# EAGLE design ventmon_t0.5b (EAGLE 9.6.2)

## Sheet 1 of 2
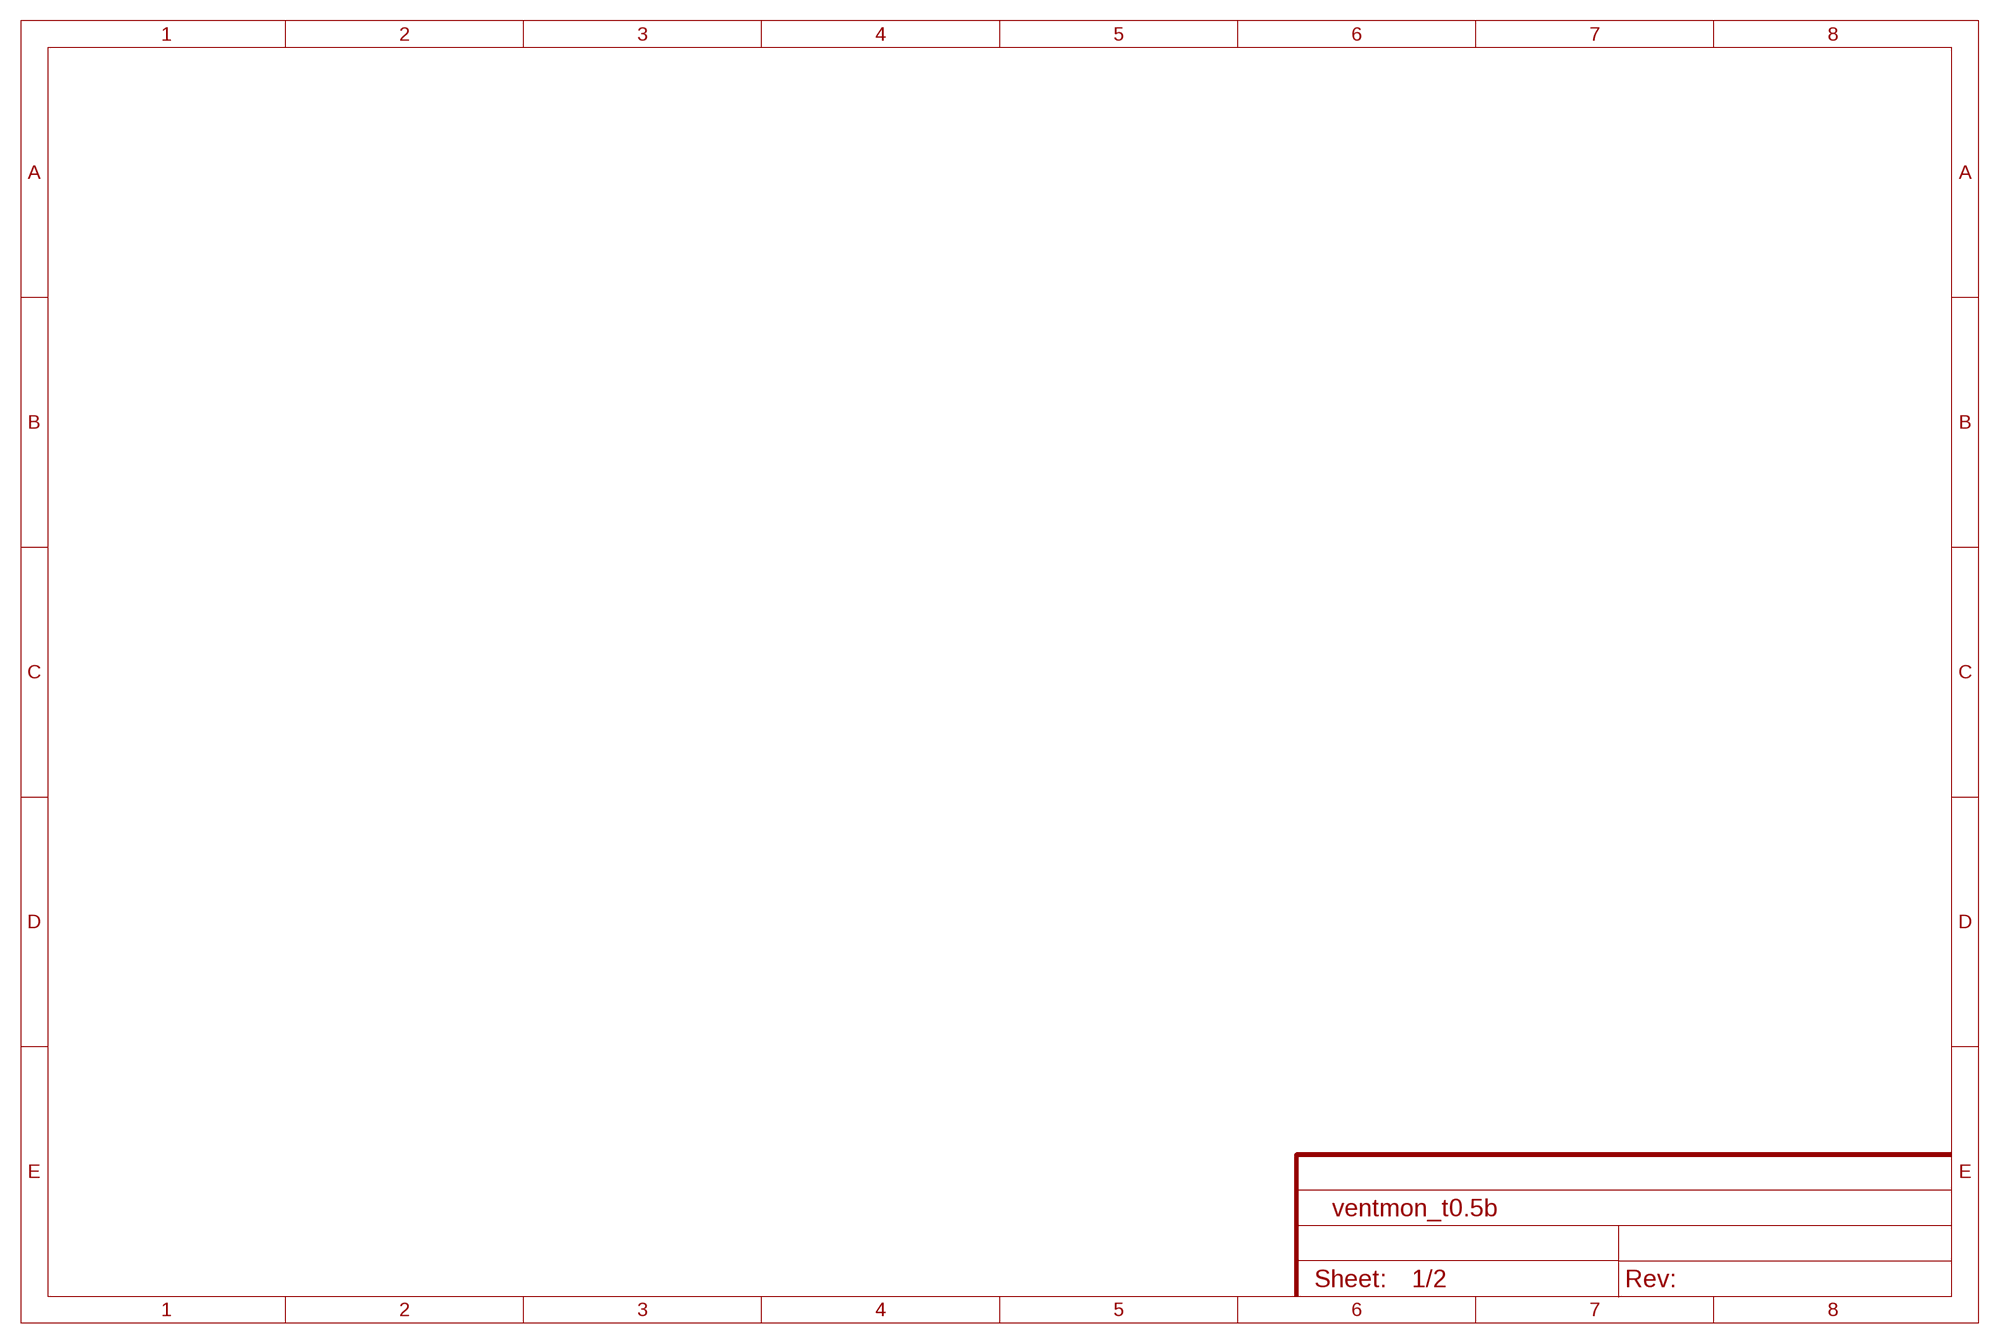
[diagram p0: schematic, sheet 1]

## Sheet 2 of 2
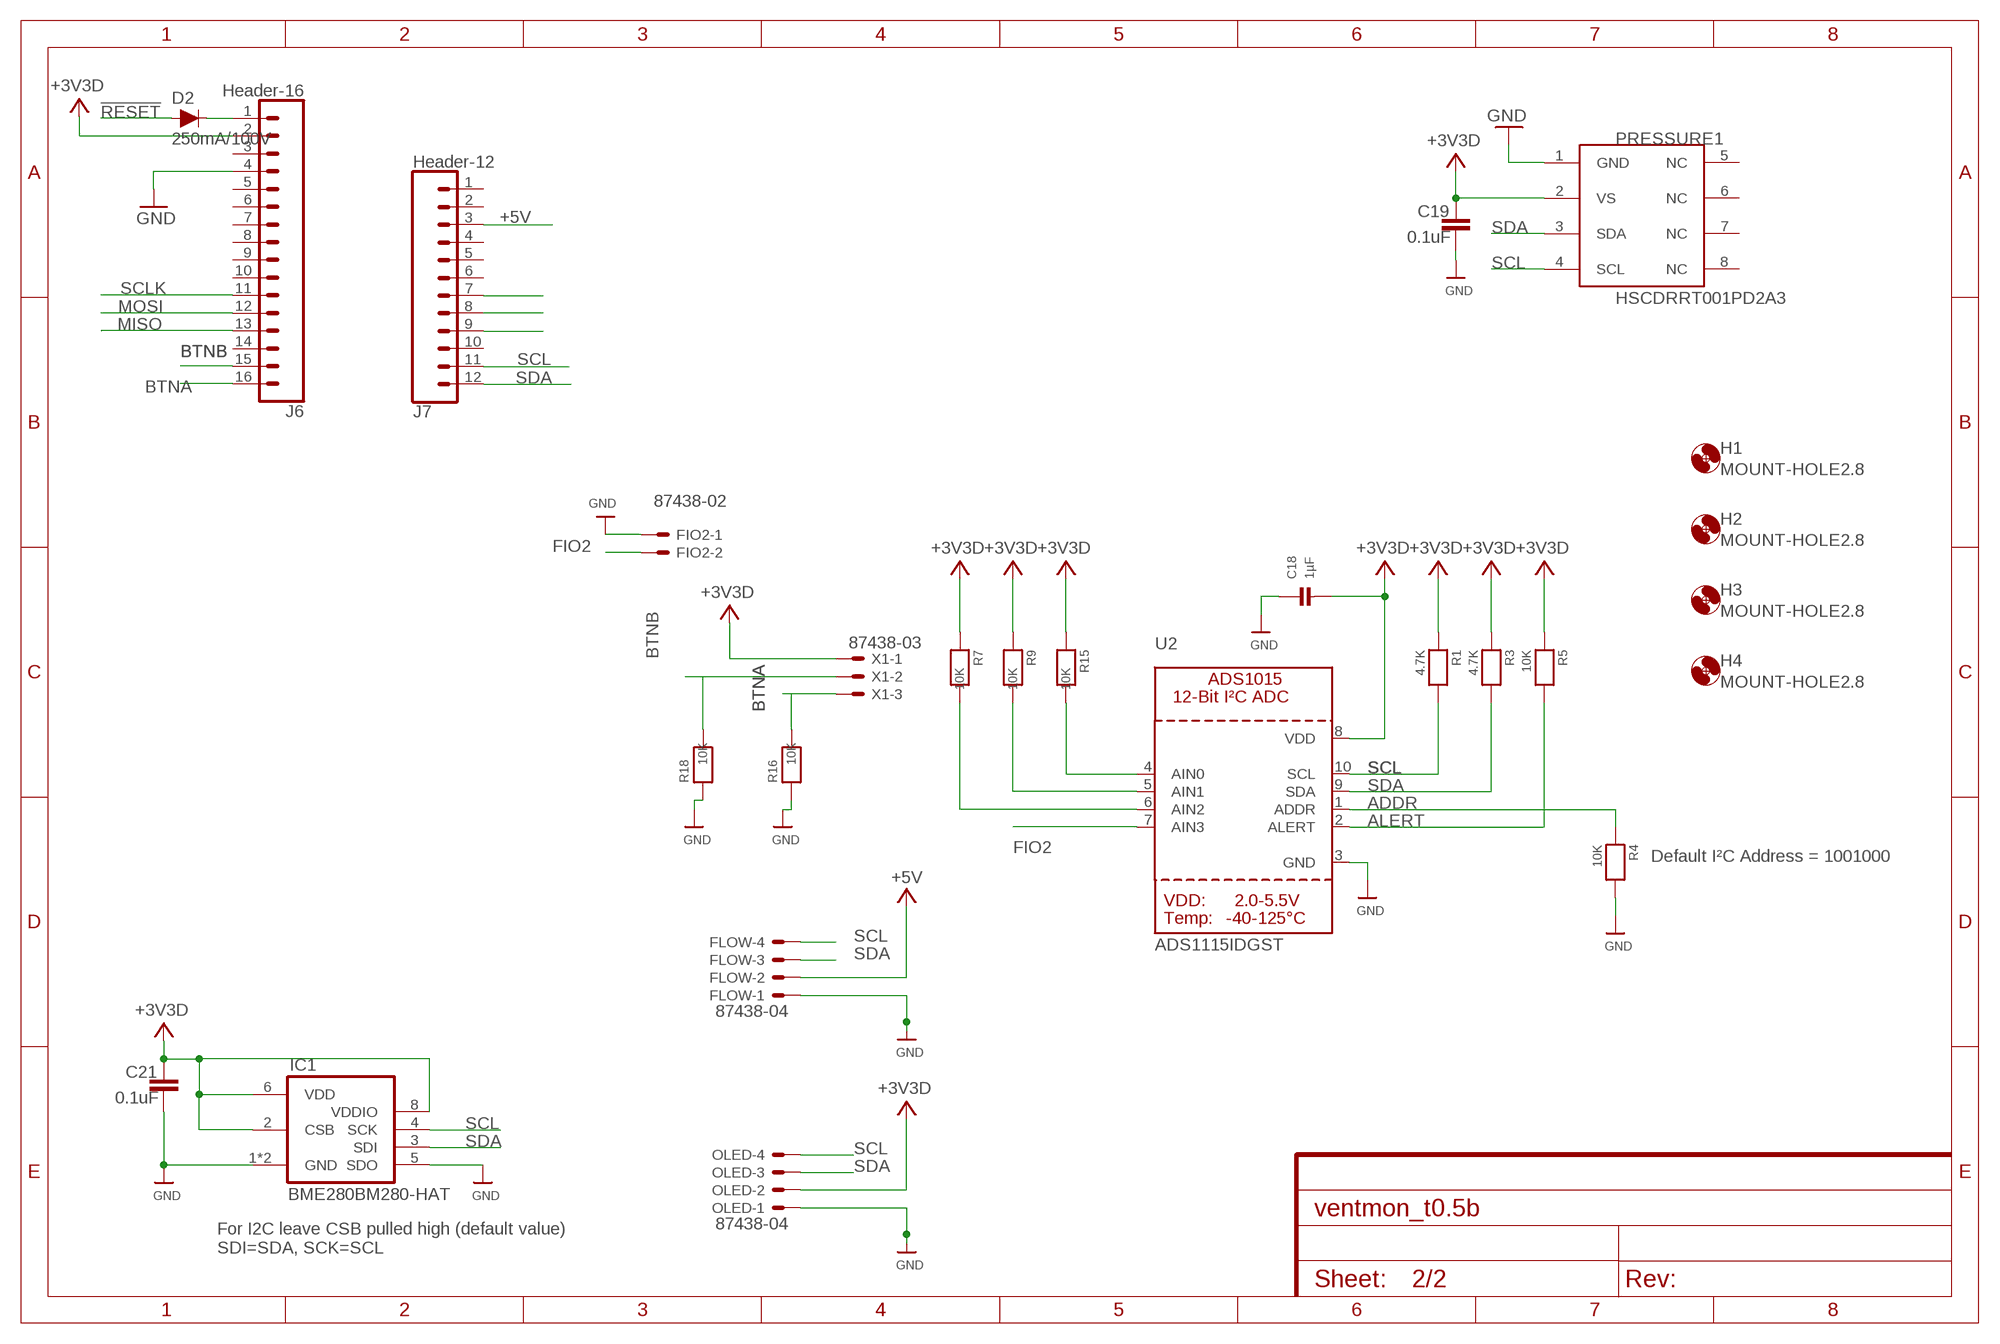
[diagram p1: schematic, sheet 2]

### Parts
C18  1µF  CAP_CERAMIC0603  [0603]
C19  0.1uF  CAP_1  [C0402_B]
C21  0.1uF  CAP_1  [C0402_B]
D2  250mA/100V  DIODE-BAS16J  [SOD-323]
FIO2  87438-02  [87438-02]
FLOW  87438-04  [87438-04]
H1  MOUNT-HOLE2.8  [2,8]
H2  MOUNT-HOLE2.8  [2,8]
H3  MOUNT-HOLE2.8  [2,8]
H4  MOUNT-HOLE2.8  [2,8]
IC1  BME280BM280-HAT  [BME280-HAT]
J6  Header-16  CONN_16  [1X16]
J7  Header-12  CONN_12  [1X12]
OLED  87438-04  [87438-04]
PRESSURE1  HSCDRRT001PD2A3  [DIP1330W46P254L1000H616Q8B]
R1  4.7K  RESISTOR0603  [0603]
R3  4.7K  RESISTOR0603  [0603]
R4  10K  RESISTOR0603  [0603]
R5  10K  RESISTOR0603  [0603]
R7  10K  RESISTOR0603  [0603]
R9  10K  RESISTOR0603  [0603]
R15  10K  RESISTOR0603  [0603]
R16  10K  RESISTOR0603  [0603]
R18  10K  RESISTOR0603  [0603]
U2  ADS1115IDGST  ADC_ADS1015  [MSOP10]
X1  87438-03  [87438-03]

### Nets
!RESET: D2.A
+3V3: C18.2 C19.2 C21.2 IC1.2(CSB) IC1.6(VDD) IC1.8(VDDIO) J6.2 OLED.2 PRESSURE1.2(VS) R1.1 R3.1 R5.1 R7.1 R9.1 R15.1 U2.8(VDD) X1.1 ; supply symbol labelled +3V3D
+5V: FLOW.2 J7.3
ADDR: R4.1 U2.1(ADDR)
ALERT: R5.2 U2.2(ALERT)
BTNA: J6.16 R16.2 X1.3
BTNB: J6.15 R18.2 X1.2
FIO2: FIO2.2 U2.7(AIN3)
GND: C18.1 C19.1 C21.1 FIO2.1 FLOW.1 IC1.1(GND) IC1.5(SDO) IC1.7(GND) J6.4 OLED.1 PRESSURE1.1(GND) R4.2 R16.1 R18.1 U2.3(GND)
MISO: J6.13
MOSI: J6.12
N$4: D2.C J6.1
N$24: J7.7
N$25: J7.8
N$26: J7.9
N$38: R7.2 U2.6(AIN2)
N$40: R9.2 U2.5(AIN1)
N$45: R15.2 U2.4(AIN0)
SCL: FLOW.4 IC1.4(SCK) J7.11 OLED.4 PRESSURE1.4(SCL) R1.2 U2.10(SCL)
SCLK: J6.11
SDA: FLOW.3 IC1.3(SDI) J7.12 OLED.3 PRESSURE1.3(SDA) R3.2 U2.9(SDA)
Unconnected: J6.3 J6.5 J6.6 J6.7 J6.8 J6.9 J6.10 J6.14 J7.1 J7.2 J7.4 J7.5 J7.6 J7.10 PRESSURE1.5(NC) PRESSURE1.6(NC) PRESSURE1.7(NC) PRESSURE1.8(NC)

### Notes on the sheet
- Default I²C Address = 1001000
- For I2C leave CSB pulled high (default value)
  SDI=SDA, SCK=SCL

## Library data of the parts
C18 = microbuilder:CAP_CERAMIC: Ceramic Capacitors 0402 - 0402 Surface Mount Capacitors 16pF 50V 5% [Digikey: 445-4899-2-ND] 18pF 50V 5% [Digikey: 490-1281-2-ND] 22pF 50V 5% [Digikey: 490-1283-2-ND] 68pF 50V 5% [Digikey: 490-1289-2-ND] 0.1uF 10V 10% [Digikey: 490-1318-2-ND] 1.0uF 6.3V 10% [Digikey: 490-1320-2-ND] 0603 - 0603 Surface Mount Capacitors 16 pF 50V 5% [Digikey: 445-5051-2-ND] 22 pF 50V [Digikey: PCC220ACVTR-ND] 33 pF 50V 5% [Digikey: 490-1415-1-ND] 56pF 50V 5% [Digikey: 490-1421-1-ND] 220pF 50V 5% [Digikey: 445-1285-1-ND] 680 pF 50V 2200 pF 50V 5% C0G [Digikey: 445-1297-1-ND] 5600 pF 100V 5% X7R [Digikey: 478-3711-1-ND] 0.1 µF 25V 10% [Digikey: PCC2277TR-ND] 0.22 µF 16V 10% X7R [Digikey: 445-1318-1-ND] 1.0 µF 25V 10% [Digikey: 445-5146-2-ND] 0603 - RF Specific 3pF 250V +/-0.1pF RF [Digikey: 712-1347-1-ND] 18 pF 250V 5% [Digikey: 478-3505-1-ND or 712-1322-1-ND] 56 pF 250V 5% C0G RF [Digikey: 490-4867-1-ND] 68 pF 250V RF [Digikey: 490-4868-1-ND] 0805 - 0805 Surface Mount Capacitors 220 pF 250V 2% RF Ceramic Capacitor [Digikey: 712-1398-1-ND] 1000 pF 50V 2% NP0 Ceramic Capacitor [Digikey: 478-3760-1-ND] 0.1 µF 25V 10% Ceramic Capacitor [Digikey: PCC1828TR-ND] 1.0 µF 16V 10% Ceramic Capacitor[Digikey: 490-1691-2-ND] 10.0 µF 10V 10% Ceramic Capacitor[Digikey: 709-1228-1-ND] 10.0 uF 16V 10% Ceramic Capacitor [Digikey: 478-5165-2-ND] 47 uF 6.3V 20% Ceramic Capacitor [Digikey: 587-1779-1-ND or 399-5506-1-ND] 1206 - 1206 Surface Mount Capacitors 47uF 10V 20% Ceramic Capacitor [Digikey: 490-5528-1-ND or 399-5508-1-ND or 445-6010-1-ND] 100uF 6.3V -20%, +80% Y5V Ceramic Capacitor (Digikey: 490-4512-1-ND, Mouser: 81-GRM31CF50J107ZE1L)
C19 C21 = Particle:CAP_1
D2 = SparkFun-DiscreteSemi:DIODE: Diode These are standard reverse protection diodes and small signal diodes. SparkFun Products: SparkFun SparkPunk Sound Kit <https://www.sparkfun.com/products/11177> SparkFun ESP8266 Thing <https://www.sparkfun.com/products/13231>; PROD_ID: DIO-09646
FIO2 = con-molex:87438-02: Wire-to-Board 1.50mm (.059") Pitch Header - Right Angle, SMT, Shrouded Source: http://www.molex.com/product/micro/87438.html; MF: MOLEX; OC_FARNELL: 1711327; OC_NEWARK: unknown
FLOW OLED = con-molex:87438-04: Wire-to-Board 1.50mm (.059") Pitch Header - Right Angle, SMT, Shrouded Source: http://www.molex.com/product/micro/87438.html; MF: MOLEX; OC_FARNELL: unknown; OC_NEWARK: unknown
H1 = holes:MOUNT-HOLE: MOUNTING HOLE with drill center marker; SPICEPREFIX: X
H2-H4 = holes:MOUNT-HOLE: MOUNTING HOLE with drill center marker
IC1 = bosch-bme280:BME280: DIGITAL HUMIDITY, PRESSURE AND TEMPERATURE SENSOR * Digital interface I²C (up to 3.4 MHz) and SPI (3 and 4 wire, up to 10 MHz)* Supply voltage VDD main supply voltage range: 1.71 V to 3.6 V*VDDIO interface voltage range: 1.2 V to 3.6 V Operating range -40…+85 °C, 0…100 % rel. humidity, 300…1100 hPa The library has been designed by Richard Magdycz <https://www.facebook.com/groups/eaglecadsoftUK>
J6 = SparkFun-Connectors:CONN_16: Multi connection point. Often used as Generic Header-pin footprint for 0.1 inch spaced/style header connections On any of the 0.1 inch spaced packages, you can populate with these: Break Away Headers - Straight <https://www.sparkfun.com/products/116> (PRT-00116) Break Away Male Headers - Right Angle <https://www.sparkfun.com/products/553> (PRT-00553) Female Headers <https://www.sparkfun.com/products/115> (PRT-00115) Break Away Headers - Machine Pin <https://www.sparkfun.com/products/117> (PRT-00117) Break Away Female Headers - Swiss Machine Pin <https://www.sparkfun.com/products/743> (PRT-00743) For SCREWTERMINALS and SPRING TERMINALS visit here: Screw Terimnals on SparkFun.com <https://www.sparkfun.com/search/results?term=Screw+Terminals> (5mm/3.5mm/2.54mm spacing) This device is also useful as a general connection point to wire up your design to another part of your project. Our various solder wires solder well into these plated through hole pads. Hook-Up Wire - Assortment (Stranded, 22 AWG) <https://www.sparkfun.com/products/11375> (PRT-11375) Hook-Up Wire - Assortment (Solid Core, 22 AWG) <https://www.sparkfun.com/products/11367> (PRT-11367) View the entire wire category on our website here <https://www.sparkfun.com/categories/141> Special notes: Molex polarized connector foot print use with SKU : PRT-08231 with associated crimp pins and housings. 1MM SMD Version SKU: PRT-10208 NOTES ON THE VARIANTS LOCK and LOCK_LONGPADS... This footprint was designed to help hold the alignment of a through-hole component (i.e. 6-pin header) while soldering it into place. You may notice that each hole has been shifted either up or down by 0.005 of an inch from it's more standard position (which is a perfectly straight line). This slight alteration caused the pins (the squares in the middle) to touch the edges of the holes. Because they are alternating, it causes a "brace" to hold the component in place. 0.005 has proven to be the perfect amount of "off-center" position when using our standard breakaway headers. Although looks a little odd when you look at the bare footprint, once you have a header in there, the alteration is very hard to notice. Also,if you push a header all the way into place, it is covered up entirely on the bottom side.
J7 = SparkFun-Connectors:CONN_12: Multi connection point. Often used as Generic Header-pin footprint for 0.1 inch spaced/style header connections On any of the 0.1 inch spaced packages, you can populate with these: Break Away Headers - Straight <https://www.sparkfun.com/products/116> (PRT-00116) Break Away Male Headers - Right Angle <https://www.sparkfun.com/products/553> (PRT-00553) Female Headers <https://www.sparkfun.com/products/115> (PRT-00115) Break Away Headers - Machine Pin <https://www.sparkfun.com/products/117> (PRT-00117) Break Away Female Headers - Swiss Machine Pin <https://www.sparkfun.com/products/743> (PRT-00743) For SCREWTERMINALS and SPRING TERMINALS visit here: Screw Terimnals on SparkFun.com <https://www.sparkfun.com/search/results?term=Screw+Terminals> (5mm/3.5mm/2.54mm spacing) This device is also useful as a general connection point to wire up your design to another part of your project. Our various solder wires solder well into these plated through hole pads. Hook-Up Wire - Assortment (Stranded, 22 AWG) <https://www.sparkfun.com/products/11375> (PRT-11375) Hook-Up Wire - Assortment (Solid Core, 22 AWG) <https://www.sparkfun.com/products/11367> (PRT-11367) View the entire wire category on our website here <https://www.sparkfun.com/categories/141> Special notes: Molex polarized connector foot print use with SKU : PRT-08231 with associated crimp pins and housings. 1MM SMD Version SKU: PRT-10208 NOTES ON THE VARIANTS LOCK and LOCK_LONGPADS... This footprint was designed to help hold the alignment of a through-hole component (i.e. 6-pin header) while soldering it into place. You may notice that each hole has been shifted either up or down by 0.005 of an inch from it's more standard position (which is a perfectly straight line). This slight alteration caused the pins (the squares in the middle) to touch the edges of the holes. Because they are alternating, it causes a "brace" to hold the component in place. 0.005 has proven to be the perfect amount of "off-center" position when using our standard breakaway headers. Although looks a little odd when you look at the bare footprint, once you have a header in there, the alteration is very hard to notice. Also,if you push a header all the way into place, it is covered up entirely on the bottom side.
PRESSURE1 = HSCDRRT001PD2A3:HSCDRRT001PD2A3: Honeywell Differential Pressure Sensor Pressure Sensor ±1PSI (±6.89kPa) Differential Male - 0.08" (1.93mm) Tube, Dual 12 b 8-DIP (0.524", 13.30mm), Dual Ports, Same Side, I2C https://www.digikey.com/product-detail/en/honeywell-sensing-and-productivity-solutions/HSCDRRT001PD2A3/480-3335-ND/2601662
R1 R3-R5 R7 R9 R15 R16 R18 = microbuilder:RESISTOR: Resistors 0402 - 0402 Surface Mount Package 22 Ohm 1% 1/16W [Digikey: 311-22.0LRTR-ND] 33 Ohm 5% 1/16W 1.0K 5% 1/16W 1.5K 5% 1/16W 2.0K 1% 1/16W 10.0K 1% 1/16W [Digikey: 311-10.0KLRTR-ND] 10.0K 5% 1/16W [Digikey: RMCF0402JT10K0TR-ND] 12.1K 1% 1/16W [Digikey: 311-22.0LRTR-ND] 100.0K 5% 1/16W 0603 - 0603 Surface Mount Package 0 Ohm 1/10 Watt 1% Resistor 15 Ohm 1/10 Watt 1% Resistor 33 Ohm 1/10 Watt 1% Resistor 49.9 Ohm 1/10 Watt 1% Resistor 100 Ohm 1/10 Watt 1% Resistor 150 Ohm 1/10 Watt 1% Resistor 240 Ohm 1/10 Watt 1% Resistor 390 Ohm 1/10 Watt 1% Resistor 560 Ohm 1/10 Watt 1% Resistor 680 Ohm 1/10 Watt 1% Resistor 750 Ohm 1/10 Watt 1% Resistor 1.0K Ohm 1/10 Watt 1% Resistor 1.5K Ohm 1/10 Watt 1% Resistor 2.0K Ohm 1/10 Watt 1% Resistor 2.2K Ohm 1/10 Watt 1% Resistor 3.3K Ohm 1/10 Watt 1% Resistor 4.7K Ohm 1/10 Watt 1% Resistor 10.0K Ohm 1/10 Watt 1% Resistor 12.0K Ohm 1/10 Watt 1% Resistor 12.1K Ohm 1/10 Watt 1% Resistor 20.0K Ohm 1/10 Watt 1% Resistor 33.0K Ohm 1/10 Watt 1% Resistor 100.0K Ohm 1/10 Watt 1% Resistor 0805 - 0805 Surface Mount Package 0 Ohm 1/8 Watt 1% Resistor 33 Ohm 1/8 Watt 1% Resistor 100 Ohm 1/8 Watt 1% Resistor 150 Ohm 1/8 Watt 1% Resistor 200 Ohm 1/8 Watt 1% Resistor 240 Ohm 1/8 Watt 1% Resistor 330 Ohm 1/8 Watt 1% Resistor 390 Ohm 1/8 Watt 1% Resistor 470 Ohm 1/8 Watt 1% Resistor 1.0K Ohm 1/8 Watt 1% Resistor 1.5K Ohm 1/8 Watt 1% Resistor 2.0K Ohm 1/8 Watt 1% Resistor 4.7K Ohm 1/8 Watt 1% Resistor 5.1K Ohm 1/8 Watt 1% Resistor 5.6K Ohm 1/8 Watt 1% Resistor 10.0K Ohm 1/8 Watt 1% Resistor 22.0K Ohm 1/8 Watt 1% Resistor 33.0K Ohm 1/8 Watt 1% Resistor 100K Ohm 1/8 Watt 1% Resistor 1206 - 1206 Surface Mount Package 2012 - 2010 Surface Mount Package 0.11 Ohm 1/2 Watt 1% Resistor - Digikey: RHM.11UCT-ND
U2 = microbuilder:ADC_ADS1015: ADS1015 - 12-bit 4-Channel I2C ADC with Internal PGA VDD: 2.0-5.5V Sampling Rate: 3.3ksps Gain Settings: 2/3, 1, 2, 4, 8, 16 I2C Address: ADDR low = 1001000x, ADDR high = 1001001x Internal Comparator The ADS1015 includes an internal comparator that can be set to output a high-level on ALERT when the conversion results exceeeds a pre-defined upper level, and will deassert itself when the level falls below a pre-defined lower threshold level. It can also be set to windowed mode where the ALERT pin will be asserted if the data exceeds the upper threshold or falls below the lower threshold.
X1 = con-molex:87438-03: Wire-to-Board 1.50mm (.059") Pitch Header - Right Angle, SMT, Shrouded Source: http://www.molex.com/product/micro/87438.html; MF: MOLEX; OC_FARNELL: 1711328; OC_NEWARK: unknown

## Board
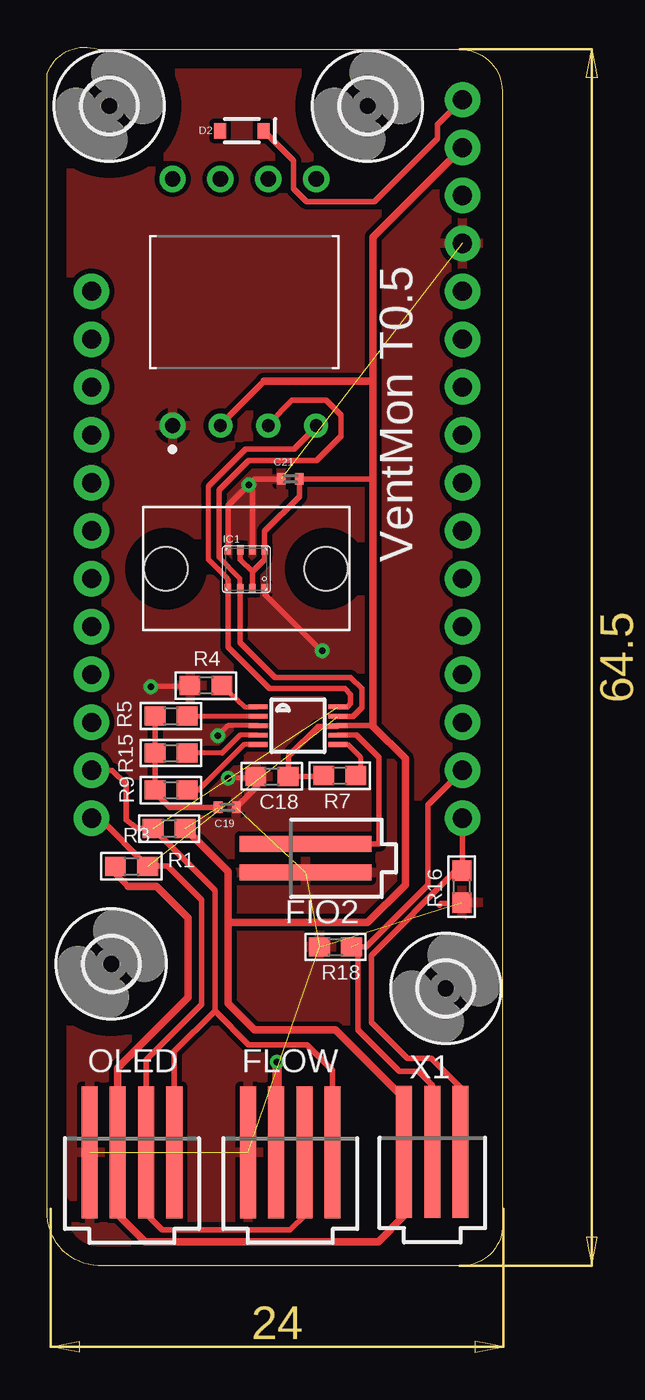
[diagram p2: board, top side]
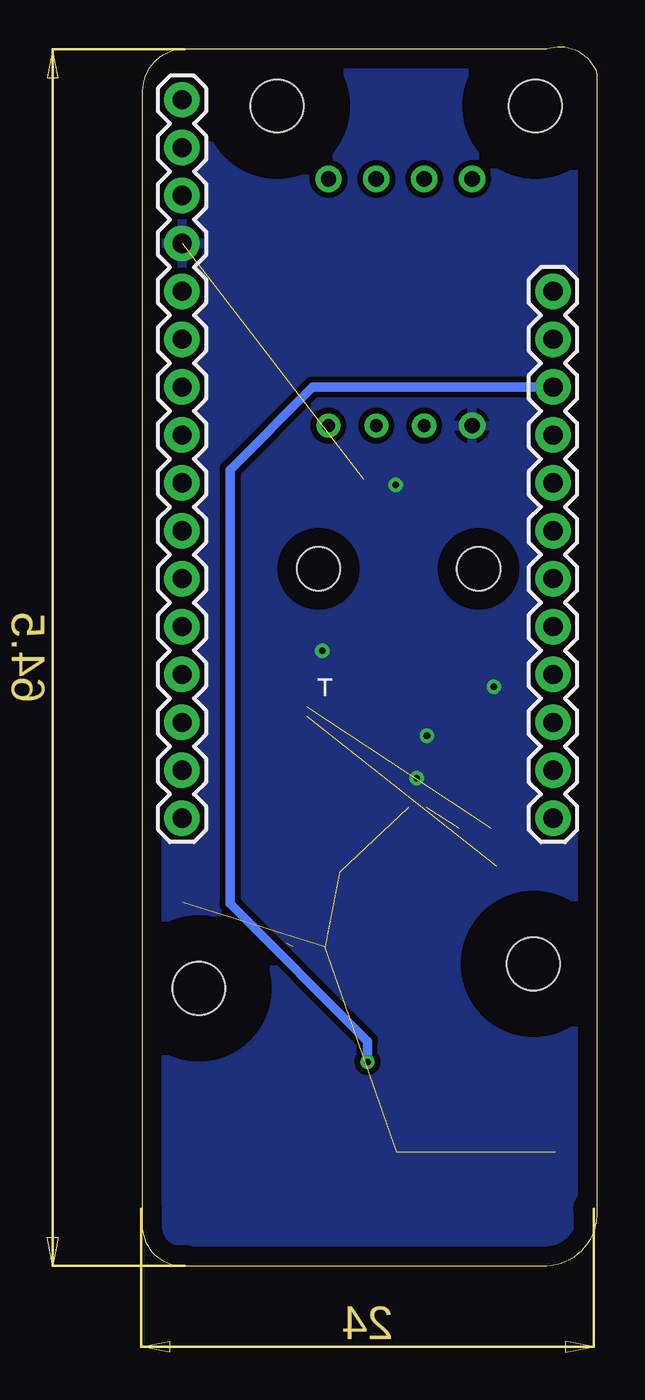
[diagram p3: board, bottom side, seen from below]

Size 24.15 x 64.62 mm. Coordinates in mm from the lower left corner, seen from the top.
Outline: 0,2.9 0,63.2 arc-90 2.7,64.5 21.9,64.5 arc-90 24.15,62.3 24.15,2 arc-90 21.9,0 2.7,0 arc-90 0,2.9
Copper layers (1*16): Top 0.035mm / dielectric 1.5mm / Bottom 0.035mm
Design rules "default *": minimum track width 6mil, minimum drill 10mil, track to track 6mil, track to pad 6mil, pad to pad 6mil, via to via 6mil, smd to smd 6mil, copper to edge 40mil, drill to drill 6mil, minimum pad ring 10mil, minimum via ring 8mil, stop-mask expansion 4mil, vias tented up to drill 0.35mm, thermal gap 10mil

### Footprints (pad centres in the part's own frame; a part is rotated, then mirrored left to right if it is on the bottom)
0603 = smd 1.1 x 1: 1 -0.85,0; 2 0.85,0
C0402_B = smd 0.457 x 0.61: 1 -0.483,0; 2 0.483,0
SOD-323 = smd 0.63 x 0.83: A 1.15,0; C -1.15,0
87438-02 = smd 7 x 0.85: 1 0,0.75; 2 0,-0.75
87438-04 = smd 7 x 0.85: 1 0,2.25; 2 0,0.75; 3 0,-0.75; 4 0,-2.25
2,8 = hole 2.8: 0,0
BME280-HAT = smd 0.35 x 0.5: 1 2.245,-2.295; 2 1.595,-2.295; 3 0.945,-2.295; 4 0.295,-2.295; 5 0.295,-0.245; 6 0.945,-0.245; 7 1.595,-0.245; 8 2.245,-0.245 | hole 2.3: 5.5,-1.25; -3,-1.25
1X16 = drill 1.016 pad 1.88: 1 0,0; 2 2.54,0; 3 5.08,0; 4 7.62,0; 5 10.16,0; 6 12.7,0; 7 15.24,0; 8 17.78,0; 9 20.32,0; 10 22.86,0; 11 25.4,0; 12 27.94,0; 13 30.48,0; 14 33.02,0; 15 35.56,0; 16 38.1,0
1X12 = drill 1.016 pad 1.88: 1 0,0; 2 2.54,0; 3 5.08,0; 4 7.62,0; 5 10.16,0; 6 12.7,0; 7 15.24,0; 8 17.78,0; 9 20.32,0; 10 22.86,0; 11 25.4,0; 12 27.94,0
DIP1330W46P254L1000H616Q8B = drill 0.813 pad 1.397: 1 -6.54,3.81; 5 6.54,-3.81; 6 6.54,-1.27; 7 6.54,1.27; 8 6.54,3.81 | drill 0.675 pad 1.275: 2 -6.54,1.27; 3 -6.54,-1.27; 4 -6.54,-3.81
MSOP10 = smd 0.25 x 1: 1 -1,-2.113; 2 -0.5,-2.113; 3 0,-2.113; 4 0.5,-2.113; 5 1,-2.113; 6 1,2.113; 7 0.5,2.113; 8 0,2.113; 9 -0.5,2.113; 10 -1,2.113
87438-03 = smd 7 x 0.85: 1 0,1.5; 2 0,0; 3 0,-1.5

### Placement (x,y rotation side)
C18  11.92,25.95 0 top
C19  9.55,24.3 180 top
C21  12.9,41.72 0 top
D2  10.33,60.18 180 top
FIO2  13.7,21.6 180 top
FLOW  12.9,6 90 top
H1  17,61.5 0 top
H2  21.15,14.7 0 top
H3  3.4,16 0 top
H4  3.3,61.5 0 top
IC1  9.3,38.2 0 top
J6  22.04,61.83 270 bottom
J7  2.36,51.67 270 bottom
OLED  4.5,6 90 top
PRESSURE1  10.46,51.09 90 top
R1  6.48,23.18 180 top
R3  4.48,21.18 0 top
R4  8.42,30.76 180 top
R5  6.57,29.15 0 top
R7  15.52,25.99 0 top
R9  6.57,25.22 0 top
R15  6.57,27.19 0 top
R16  22,20.1 90 top
R18  15.3,16.9 0 top
U2  13.31,28.64 270 top
X1  20.43,6.03 90 top

### Tracks (layer width: path | path; a pad name or v marks a point on that pad's centre or on a via)
+3V3  (1 unrouted)
  Top 0.2: 10.9,36.8 10.89,36.8
  Top 0.305: IC1.6 10.24,37.46 10.9,36.8 11.54,37.45 IC1.8 11.54,38.95 13.38,40.78 C21.2 | 10.89,36.8 IC1.2 10.89,35.96 | R7.1 14.64,25.95 C18.2 12.82,27.02 14.4,28.6 15.39,28.6 U2.8 17.3,28.64 | 5.62,25.28 5.7,25.25 R9.1 | OLED.2 3.75,2.72 | 18.93,2.64 X1.1 | X1.1 18.93,9.33 | X1.1 18.93,8.87 | 13.38,41.82 C21.2 | C21.2 13.4,41.7 17.3,41.7 | 11.5,46.9 9.19,44.6 PRESSURE1.2 | R1.1 7.12,23.48 | R9.1 5.8,25.15 | R9.1 R15.1 R5.1 | R9.1 5.73,25.1 6.53,24.3 C19.2 | 4.3,20.1 3.63,20.78 R3.1
  Top 0.406: 5.42,25.22 R9.1 | 3.75,2.72 5.2,1.27 17.57,1.27 18.93,2.64 | 18.93,8.87 15.3,12.5 11,12.5 9.6,13.9 9.6,18.2 | OLED.2 3.75,10.5 7.48,14.23 7.48,18.43 5.8,20.1 4.3,20.1 | 9.6,18.2 17,18.2 19,20.2 19,26.9 17.3,28.6 17.3,28.64 17.3,41.7 17.3,46.9 | 9.6,18.2 9.6,20.9 R1.1 | J6.2 17.3,54.55 17.3,46.9 | 11.5,46.9 17.3,46.9
+5V  (via drill 0.35)
  Top 0.508: v12.2,10.8 12.2,6.05 FLOW.2
  Bottom 0.508: J7.3 15.11,46.59 19.5,42.2 19.5,19.2 12.2,11.9 v12.2,10.8 12.2,10.7
ADDR
  Top 0.254: R4.1 10.5,29.64 U2.1
ALERT
  Top 0.254: U2.2 7.51,29.14 R5.2
BTNA
  Top 0.305: X1.3 21.93,9.46 20.4,10.99 19.11,10.99 17.2,12.9 17.2,16.45 21.7,20.95 R16.2 22.04,20.99 J6.16
BTNB  (1 unrouted)
  Top 0.305: X1.2 20.43,9.57 19.7,10.3 18.7,10.3 16.5,12.5 16.5,16.9 R18.2 16.92,16.9 20.2,20.18 20.2,24.43 J6.15 | 16.5,17.1 16.4,17.2
FIO2
  Top 0.305: FIO2.2 17.6,22.35 17.6,26.95 16.42,28.14 U2.7
GND  (via drill 0.35)  (6 unrouted)
  Top 0.254: 11,41.72 11,41.7 v10.7,41.4 10.89,41.6 | IC1.1 11.54,35.61 14.55,32.6 v14.6,32.6 | R4.2 7.42,30.7 v5.5,30.7 | C18.1 11.07,25.85 v9.6,25.85 | U2.3 9.58,28.64 v9.05,28.1
  Top 0.305: C21.1 11,41.72 | 10.89,41.6 IC1.7 | IC1.5 9.59,40.3 v10.7,41.4 | C18.1 11.13,26 11.13,25.4 C19.1
  pour Top (isolate 0.254): -0.4,65 -0.4,-0.82 24.6,-0.82 24.6,65
  pour Bottom (isolate 0.305): -1,65.6 -1,0.7 1.5,-1.8 22.8,-1.8 25.2,0.6 25.2,65.6
MISO
  Top 0.203: 21.94,31.45 J6.13
N$4
  Top 0.305: J6.1 20.71,60.5 20.71,59.77 17.37,56.43 13.76,56.43 13.07,57.12 13.07,58.59 D2.C
N$8
  Top 0.305: 20.8,19.1 20.9,19.2 21.2,19.2
N$38
  Top 0.254: U2.6 15.97,27.64 16.62,26.99 16.62,26.2 R7.2
N$40
  Top 0.254: U2.5 10.44,27.64 8.02,25.22 R9.2
N$45
  Top 0.254: R15.2 9.28,27.19 10.23,28.14 U2.4
SCL  (1 unrouted)
  Top 0.254: IC1.4 9.59,36.41 8.57,37.44 8.57,41.34
  Top 0.305: FLOW.4 15.15,10.35 13.8,11.7 10.7,11.7 8.9,13.5 | J7.11 3.46,26.27 4.2,25.53 4.2,23.64 4.8,23.18 R1.2 8.9,19.9 8.9,13.5 | U2.10 15.93,29.64 16.1,29.8 16.1,30.3 15.8,30.6 11.8,30.6 9.59,32.81 IC1.4 | 8.57,41.34 10.53,43.3 13.1,43.3 14.27,44.48 PRESSURE1.4 | 8.9,13.5 6.75,11.35 OLED.4
  Bottom 0.152: J7.11
SDA  (1 unrouted)
  Top 0.2: 10.22,35.93 IC1.3 | 5.2,4.7 5.2,4.9 5.25,4.95 5.25,5.5
  Top 0.254: 10.22,35.93 10.22,36.46 9.12,37.57
  Top 0.305: OLED.3 5.25,5.5 | FLOW.3 13.7,5.95 13.7,2.7 12.9,1.9 6.1,1.9 5.3,2.7 5.3,5.95 OLED.3 | 9.11,37.57 9.12,37.57 9.12,37.58 9.11,37.58 9.11,41.12 10.7,42.7 14.3,42.7 15.6,44 15.6,45.1 14.8,45.9 13,45.9 11.73,44.64 PRESSURE1.3 | IC1.3 10.24,33.06 12.1,31.2 16.1,31.2 16.7,30.6 16.7,29.6 16.23,29.14 U2.9 | R3.2 2.8,23.73 J7.12 | R3.2 5.1,21.3 | OLED.3 5.25,10.9 8.2,13.85 8.2,19.4 6.4,21.2 5.35,21.2 R3.2

### Text on the board
tPlace: VentMon T0.5
bPlace: VentMon T0.5 | Public Invention